# EAGLE design KL02BadgeLeds (EAGLE 6.5.0)
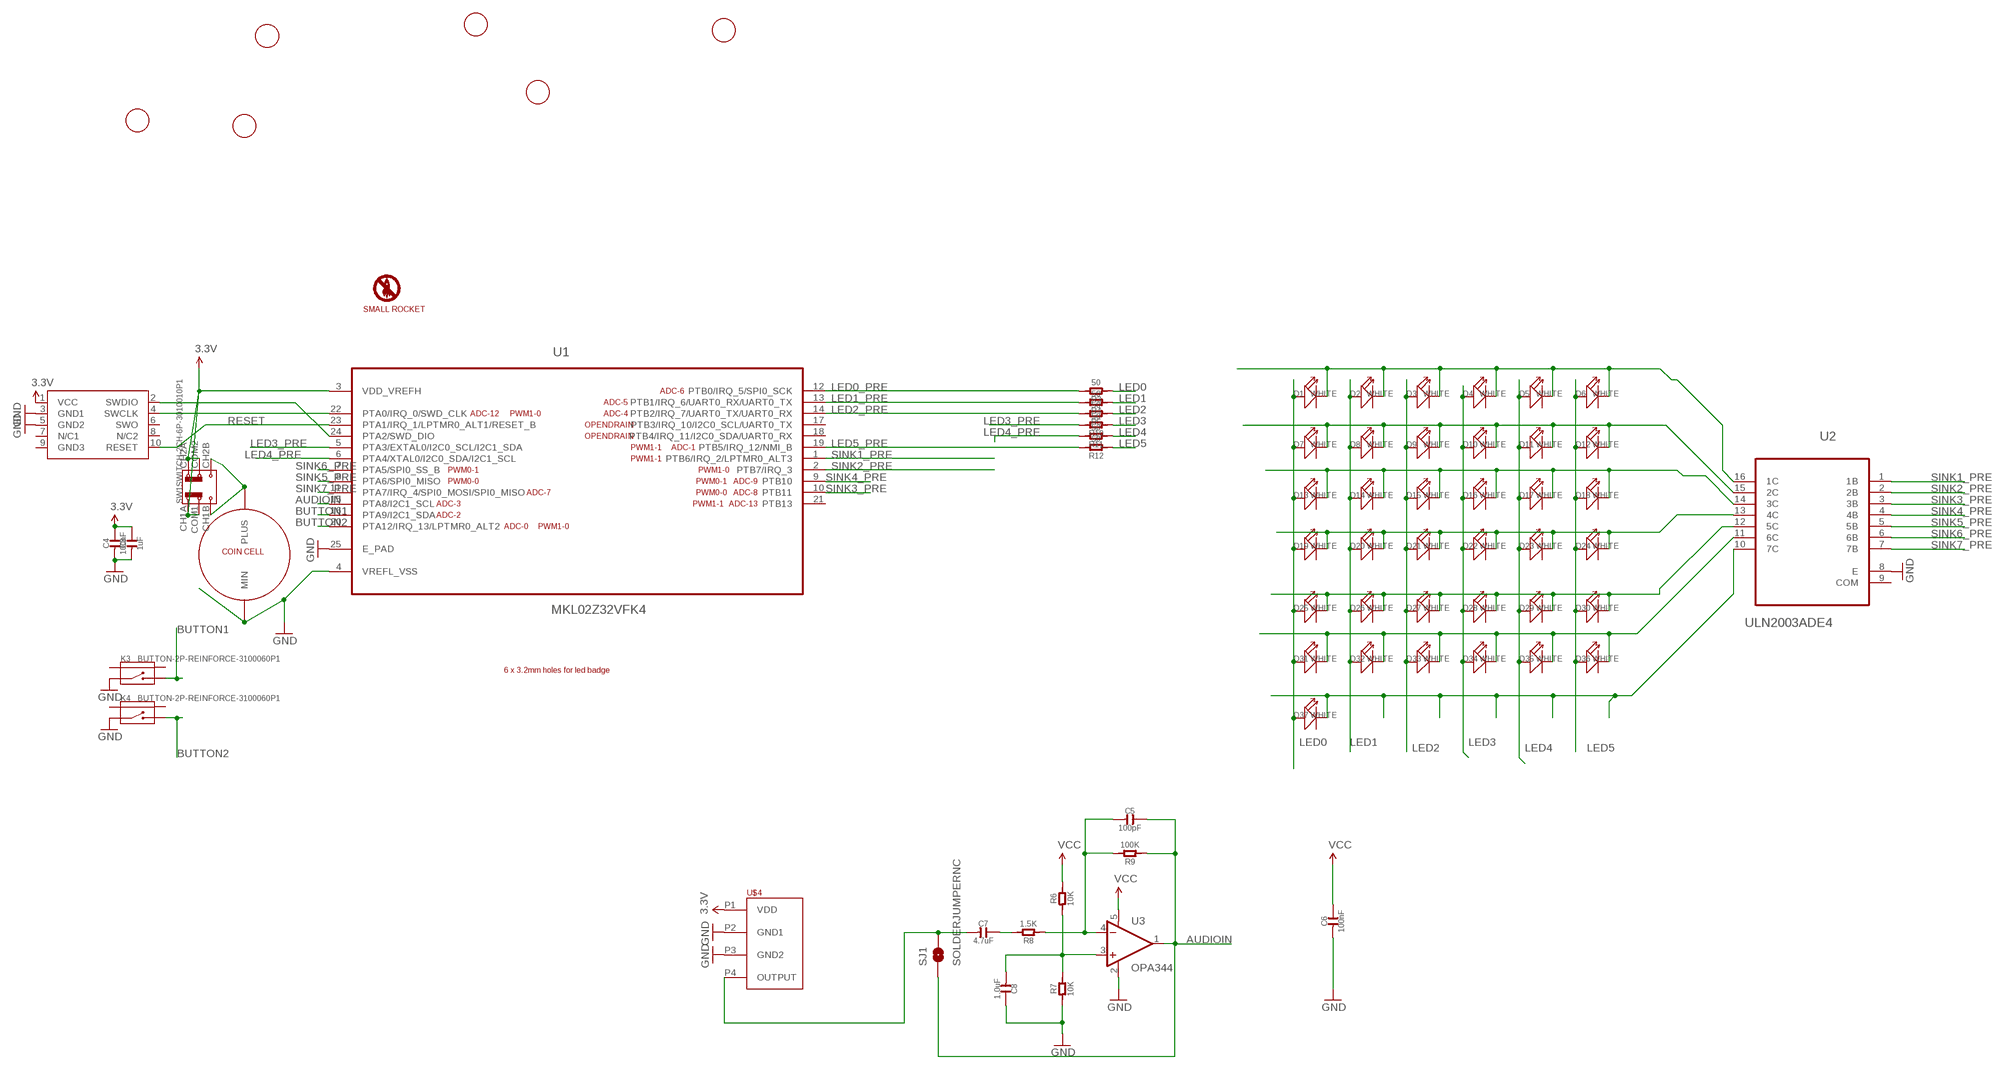
[diagram p0: schematic, sheet 1]

## Parts
C3  1uF  C-0603  [C0603]
C4  100nF  C-0603  [C0603]
C5  100pF  C-0603  [C0603]
C6  100nF  C-0603  [C0603]
C7  4.7uF  C-0603  [C0603]
C8  1.0uF  C-0603  [C0603]
D1  WHITE  LED  [LED0805]
D2  WHITE  LED  [LED0805]
D3  WHITE  LED  [LED0805]
D4  WHITE  LED  [LED0805]
D5  WHITE  LED  [LED0805]
D6  WHITE  LED  [LED0805]
D7  WHITE  LED  [LED0805]
D8  WHITE  LED  [LED0805]
D9  WHITE  LED  [LED0805]
D10  WHITE  LED  [LED0805]
D11  WHITE  LED  [LED0805]
D12  WHITE  LED  [LED0805]
D13  WHITE  LED  [LED0805]
D14  WHITE  LED  [LED0805]
D15  WHITE  LED  [LED0805]
D16  WHITE  LED  [LED0805]
D17  WHITE  LED  [LED0805]
D18  WHITE  LED  [LED0805]
D19  WHITE  LED  [LED0805]
D20  WHITE  LED  [LED0805]
D21  WHITE  LED  [LED0805]
D22  WHITE  LED  [LED0805]
D23  WHITE  LED  [LED0805]
D24  WHITE  LED  [LED0805]
D25  WHITE  LED  [LED0805]
D26  WHITE  LED  [LED0805]
D27  WHITE  LED  [LED0805]
D28  WHITE  LED  [LED0805]
D29  WHITE  LED  [LED0805]
D30  WHITE  LED  [LED0805]
D31  WHITE  LED  [LED0805]
D32  WHITE  LED  [LED0805]
D33  WHITE  LED  [LED0805]
D34  WHITE  LED  [LED0805]
D35  WHITE  LED  [LED0805]
D36  WHITE  LED  [LED0805]
D37  WHITE  LED  [LED0805]
K3  BUTTON-2P-REINFORCE-3100060P1  [4P-SMD-7.0X3.5X3.5H-90D]
K4  BUTTON-2P-REINFORCE-3100060P1  [4P-SMD-7.0X3.5X3.5H-90D]
R3  50  R-0603  [R0603]
R4  50  R-0603  [R0603]
R5  50  R-0603  [R0603]
R6  10K  R-0603  [R0603]
R7  10K  R-0603  [R0603]
R8  1.5K  R-0603  [R0603]
R9  100K  R-0603  [R0603]
R10  50  R-0603  [R0603]
R11  50  R-0603  [R0603]
R12  50  R-0603  [R0603]
SJ1  SOLDERJUMPERNC  [SJ_2S]
SW1  SWITCH-2CH-6P-3010010P1  [6P-2CH-2.54-9.1X3.5X3.2+2H]
SWD1  CORTEX_SWD  [M50-3600542]
U1  MKL02Z32VFK4  [QFN50P400X400X100-25N]
U2  ULN2003ADE4  [SOIC127P600X175-16N]
U3  OPA344  [SOT23-5]
U$1  SMALLROCKET  [SMALLROCKET]
U$2  COINCELL  [2032HOLDER-SZ]
U$3  FIDUCIAL  [FIDUCIAL_1MM]
U$4  WM7120A  [LGAMS4]
U$5  BADGE_HOLES  [BADGEHOLES]
U$6  FIDUCIAL  [FIDUCIAL_1MM]
U$7  FIDUCIAL  [FIDUCIAL_1MM]
U$8  FIDUCIAL  [FIDUCIAL_1MM]
U$9  FIDUCIAL  [FIDUCIAL_1MM]
U$10  FIDUCIAL  [FIDUCIAL_1MM]

## Nets
3.3V: C3.2 C4.2 C6.2 R6.2 SW1.CH1A SW1.CH2A SW1.COM1 SW1.COM2 SWD1.1(VCC) U1.3(VDD_VREFH) U3.5(V+) U$4.P1(VDD) ; supply symbol labelled VCC
AUDIOIN: C5.2 R9.1 SJ1.1 U1.15(PTA8/I2C1_SCL) U3.1(OUT)
BUTTON1: K3.2 U1.16(PTA9/I2C1_SDA)
BUTTON2: K4.2 U1.20(PTA12/IRQ_13/LPTMR0_ALT2)
GND: C3.1 C4.1 C6.1 C8.2 K3.1 K4.1 R7.1 SWD1.3(GND1) SWD1.5(GND2) U1.4(VREFL_VSS) U1.25(E_PAD) U2.8(E) U3.2(V-) U$2.MIN U$4.P2(GND1) U$4.P3(GND2)
LED0: D1.+ D7.+ D13.+ D19.+ D25.+ D31.+ D37.+ R3.1
LED0_PRE: R3.2 U1.12(PTB0/IRQ_5/SPI0_SCK)
LED1: D2.+ D8.+ D14.+ D20.+ D26.+ D32.+ R4.1
LED1_PRE: R4.2 U1.13(PTB1/IRQ_6/UART0_RX/UART0_TX)
LED2: D3.+ D9.+ D15.+ D21.+ D27.+ D33.+ R5.1
LED2_PRE: R5.2 U1.14(PTB2/IRQ_7/UART0_TX/UART0_RX)
LED3: D4.+ D10.+ D16.+ D22.+ D28.+ D34.+ R10.1
LED3_PRE: R10.2 U1.5(PTA3/EXTAL0/I2C0_SCL/I2C1_SDA)
LED4: D5.+ D11.+ D17.+ D23.+ D29.+ D35.+ R11.1
LED4_PRE: R11.2 U1.6(PTA4/XTAL0/I2C0_SDA/I2C1_SCL)
LED5: D6.+ D12.+ D18.+ D24.+ D30.+ D36.+ R12.1
LED5_PRE: R12.2 U1.19(PTB5/IRQ_12/NMI_B)
N$1: SW1.CH1B SW1.CH2B U$2.PLUS
N$5: SWD1.4(SWCLK) U1.22(PTA0/IRQ_0/SWD_CLK)
N$7: SWD1.2(SWDIO) U1.24(PTA2/SWD_DIO)
N$8: C7.1 SJ1.2 U$4.P4(OUTPUT)
N$9: C5.1 R8.1 R9.2 U3.4(-IN)
N$10: C7.2 R8.2
N$11: C8.1 R6.1 R7.2 U3.3(+IN)
RESET: SWD1.10(RESET) U1.23(PTA1/IRQ_1/LPTMR0_ALT1/RESET_B)
SINK1: D1.- D2.- D3.- D4.- D5.- D6.- U2.16(1C)
SINK1_PRE: U1.1(PTB6/IRQ_2/LPTMR0_ALT3) U2.1(1B)
SINK2: D7.- D8.- D9.- D10.- D11.- D12.- U2.15(2C)
SINK2_PRE: U1.2(PTB7/IRQ_3) U2.2(2B)
SINK3: D13.- D14.- D15.- D16.- D17.- D18.- U2.14(3C)
SINK3_PRE: U1.10(PTB11) U2.3(3B)
SINK4: D19.- D20.- D21.- D22.- D23.- D24.- U2.13(4C)
SINK4_PRE: U1.9(PTB10) U2.4(4B)
SINK5: D25.- D26.- D27.- D28.- D29.- D30.- U2.12(5C)
SINK5_PRE: U1.8(PTA6/SPI0_MISO) U2.5(5B)
SINK6: D31.- D32.- D33.- D34.- D35.- D36.- U2.11(6C)
SINK6_PRE: U1.7(PTA5/SPI0_SS_B) U2.6(6B)
SINK7: D37.- U2.10(7C)
SINK7_PRE: U1.11(PTA7/IRQ_4/SPI0_MOSI/SPI0_MISO) U2.7(7B)
Unconnected: K3.S1 K3.S2 K4.S1 K4.S2 SWD1.6(SWO) SWD1.7(N/C1) SWD1.8(N/C2) SWD1.9(GND3) U1.17(PTB3/IRQ_10/I2C0_SCL/UART0_TX) U1.18(PTB4/IRQ_11/I2C0_SDA/UART0_RX) U1.21(PTB13) U2.9(COM)

## Library data of the parts
C3-C8 = OPL:C*
D1-D37 = BatteryHolder:LED*: LED
K3 K4 = OPL:BUTTON-2P-REINFORCE: TS-1188E http://www.best-dz.com/?thread-374-2.html SMD Button
R3-R12 = OPL:R*
SJ1 = SparkFun-Passives:SOLDERJUMPER: Solder Jumper Standard SMD solder jumper. Used to automate production. Two varients : Normally Open and Normally Closed are the same, but have different paste layers. NC will have a large amount of paste and should jumper during reflow.
SW1 = OPL:SWITCH-2CH-6P*: MS-22D18 G2 ROHS
SWD1 = carrilib with jtags:CORTEX_SWD: .05" Cortex M Connector in SWD mode Manufacturer: Generic Part Number: Cortex M SWD Notes: I use Harwin M50-3600542 connectors
U1 = FarnellThings:MKL02Z32VFK4: IC, MCU, 32BIT, CORTEX M0+, 48MHZ, QFN-24; MPN: MKL02Z32VFK4; OC_FARNELL: 2321481; OC_NEWARK: 61W9887; PACKAGE: QFN-24; SUPPLIER: FREESCALE SEMICONDUCTOR
U2 = BatteryHolder:ULN2003ADE4: DARLINGTON TRANSISTOR ARRAYS; MPN: ULN2003ADE4; OC_FARNELL: 1125398; OC_NEWARK: 93K1078; PACKAGE: SOIC-16; SUPPLIER: Texas Instruments
U3 = SparkFun:OPA344
U$1 = zephod-components:SMALLROCKET
U$2 = BatteryHolder:COINCELL
U$3 U$6-U$10 = adafruit:FIDUCIAL: For use by pick and place machines to calibrate the vision/machine, 1mm By microbuilder.eu
U$4 = KL02Z:WM7120A
U$5 = BatteryHolder:BADGE_HOLES

## Net classes
0 default: width 0.203 mm

## Board
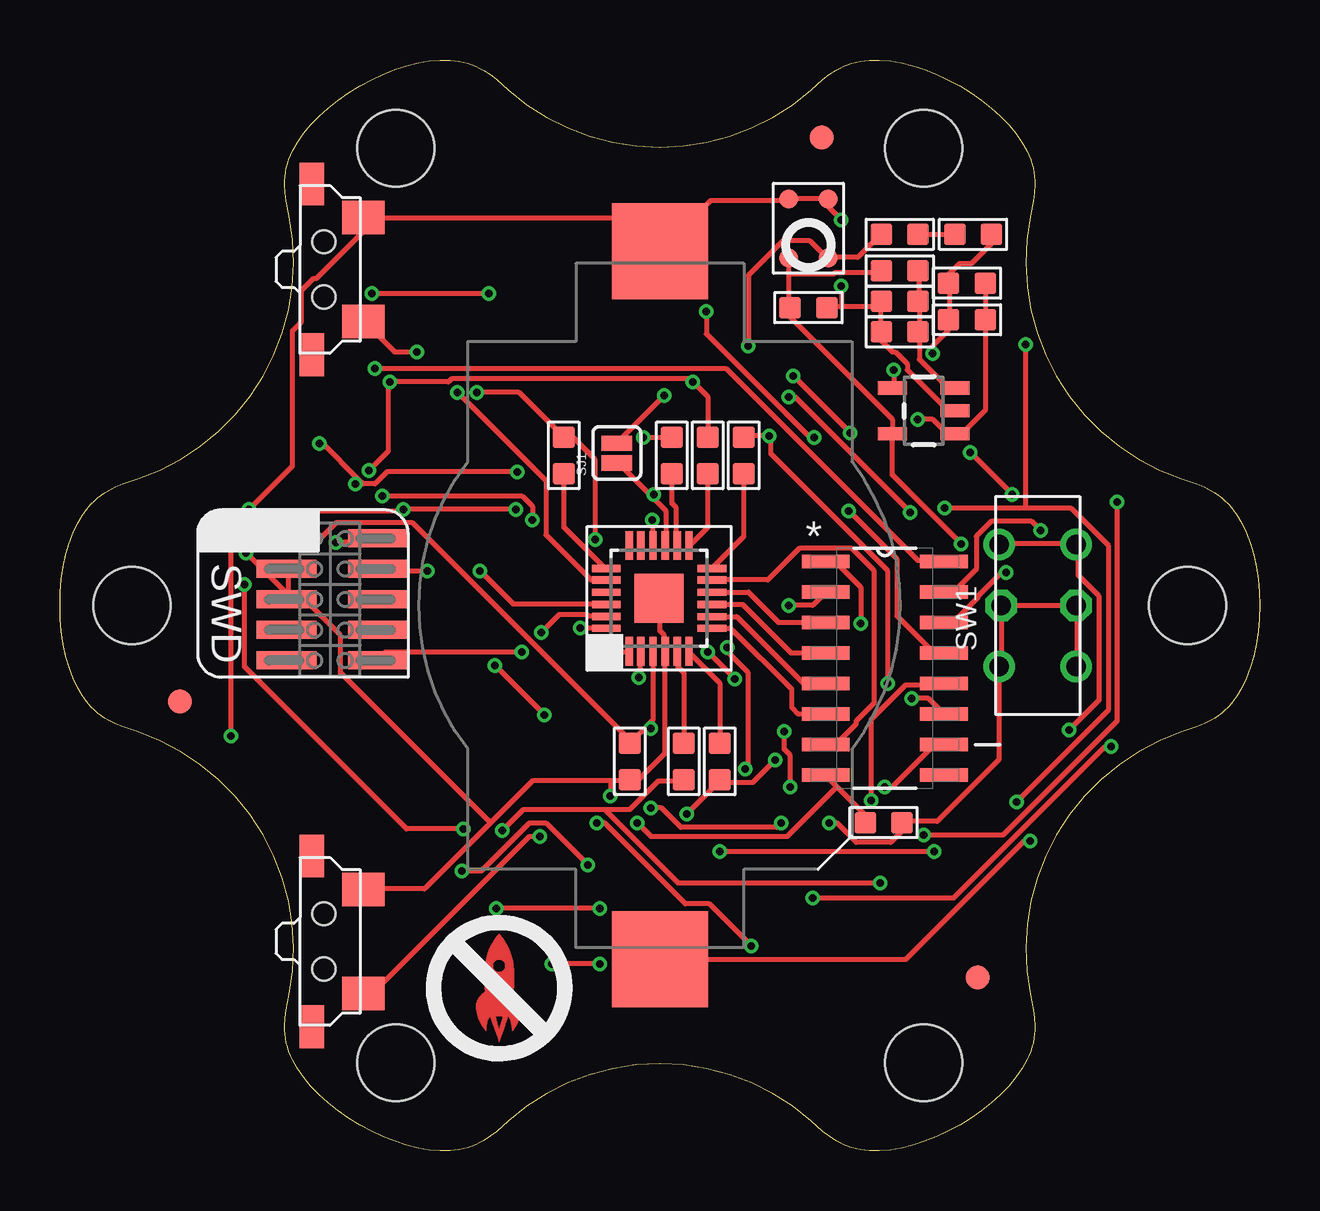
[diagram p1: board, top side]
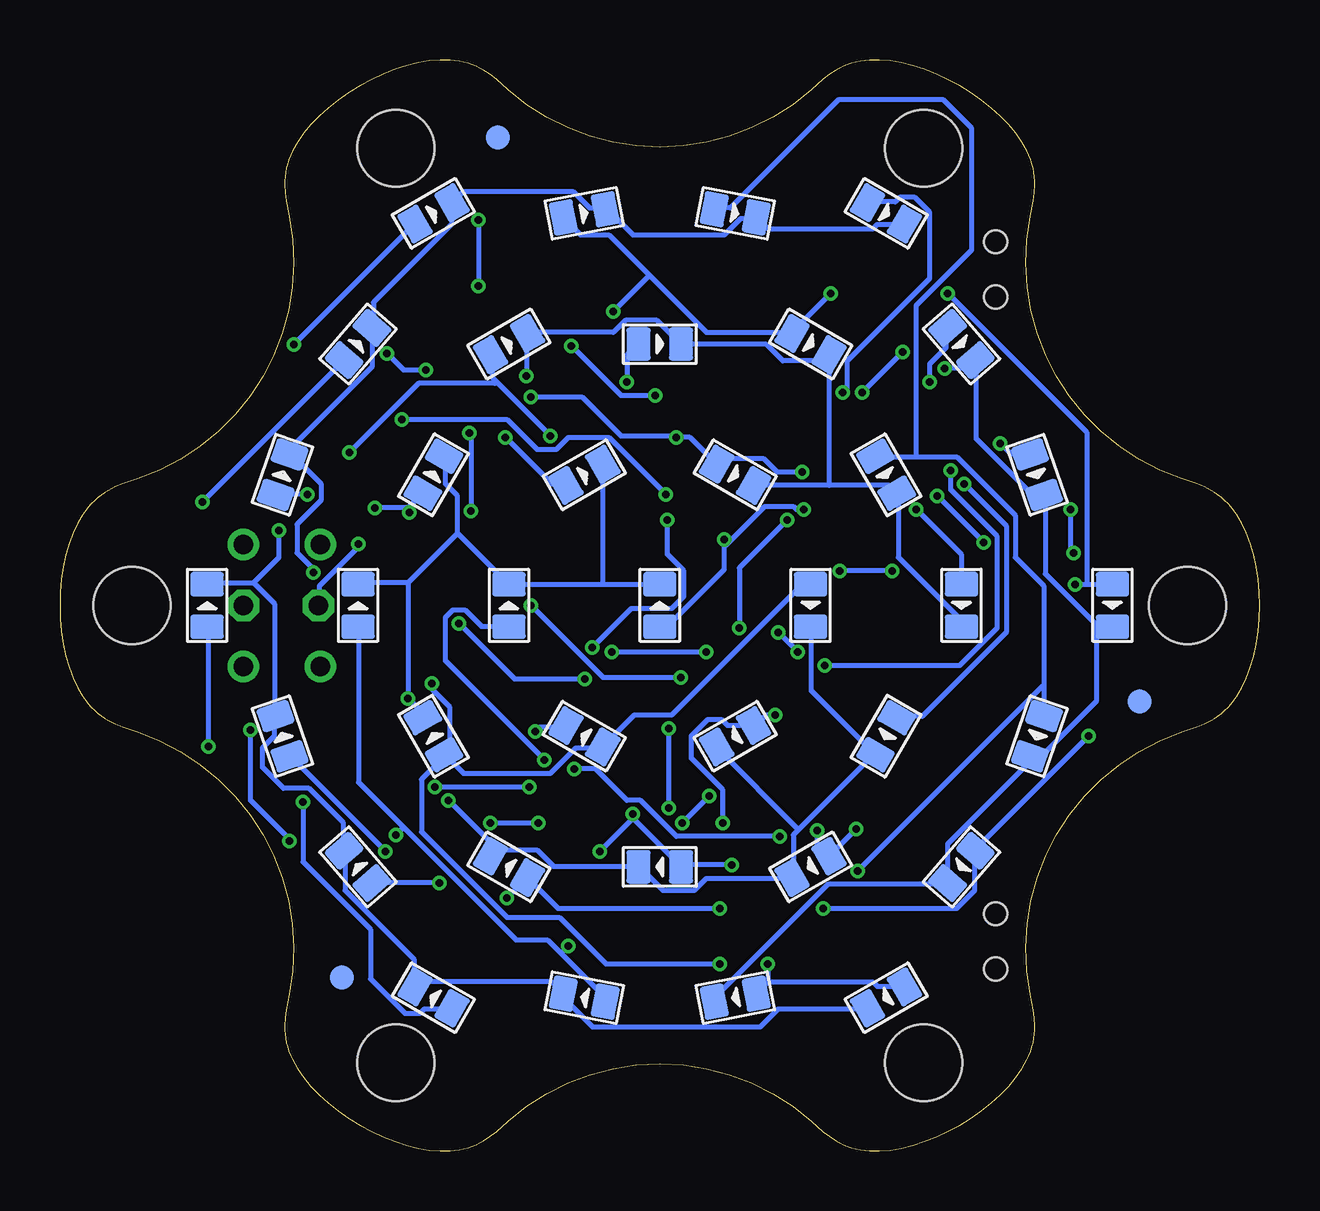
[diagram p2: board, bottom side, seen from below]

Size 50 x 45.45 mm. Coordinates in mm from the lower left corner, seen from the top.
Outline: 18.68,44.21 19.46,43.6 20.29,43.07 21.17,42.62 22.09,42.28 23.04,42.03 24.02,41.87 25,41.82 25.98,41.87 26.96,42.03 27.91,42.28 28.83,42.62 29.71,43.07 30.54,43.6 31.32,44.21 31.81,44.65 32.07,44.85 32.35,45.04 32.5,45.12 32.66,45.19 32.82,45.26 32.99,45.32 33.17,45.36 33.36,45.4 33.55,45.43 33.75,45.45 34.17,45.45 34.61,45.42 35.07,45.34 35.55,45.22 36.04,45.06 36.53,44.87 37.02,44.64 37.5,44.38 37.97,44.09 38.41,43.78 38.82,43.45 39.2,43.11 39.55,42.76 39.85,42.39 40.1,42.03 40.3,41.66 40.39,41.48 40.46,41.3 40.52,41.12 40.56,40.94 40.6,40.77 40.62,40.59 40.64,40.42 40.64,40.25 40.62,39.91 40.58,39.58 40.45,38.94 40.3,37.96 40.26,36.98 40.32,35.99 40.48,35.02 40.73,34.07 41.09,33.15 41.54,32.27 42.07,31.45 42.69,30.68 43.39,29.98 44.15,29.36 44.97,28.82 45.84,28.36 46.76,28 47.39,27.79 47.7,27.67 48,27.51 48.14,27.42 48.28,27.33 48.42,27.22 48.56,27.1 48.69,26.97 48.81,26.83 48.94,26.68 49.05,26.51 49.27,26.15 49.45,25.75 49.62,25.31 49.75,24.84 49.86,24.34 49.94,23.81 49.98,23.27 50,22.73 49.98,22.18 49.94,21.64 49.86,21.12 49.75,20.62 49.62,20.14 49.45,19.7 49.27,19.3 49.05,18.94 48.94,18.78 48.81,18.63 48.69,18.49 48.56,18.36 48.42,18.24 48.28,18.13 48.14,18.03 48,17.94 47.7,17.79 47.39,17.67 46.76,17.46 45.84,17.09 44.97,16.64 44.15,16.1 43.39,15.47 42.69,14.77 42.07,14.01 41.54,13.18 41.09,12.3 40.73,11.38 40.48,10.43 40.32,9.46 40.26,8.48 40.3,7.49 40.45,6.52 40.58,5.87 40.62,5.54 40.64,5.21 40.64,5.03 40.62,4.86 40.6,4.69 40.56,4.51 40.52,4.33 40.46,4.15 40.39,3.97 40.3,3.79 40.1,3.43 39.85,3.06 39.55,2.7 39.2,2.34 38.82,2 38.41,1.67 37.97,1.36 37.5,1.08 37.02,0.82 36.53,0.59 36.04,0.39 35.55,0.23 35.07,0.12 34.61,0.04 34.17,0 33.75,0.01 33.55,0.02 33.36,0.05 33.17,0.09 32.99,0.14 32.82,0.2 32.66,0.26 32.5,0.34 32.35,0.42 32.07,0.6 31.81,0.81 31.32,1.25 30.54,1.86 29.71,2.39 28.83,2.83 27.91,3.18 26.96,3.43 25.98,3.58 25,3.63 24.02,3.58 23.04,3.43 22.09,3.18 21.17,2.83 20.29,2.39 19.46,1.86 18.68,1.25 18.19,0.81 17.93,0.6 17.65,0.42 17.5,0.34 17.34,0.26 17.18,0.2 17.01,0.14 16.83,0.09 16.64,0.05 16.45,0.02 16.25,0.01 15.83,0 15.39,0.04 14.93,0.12 14.45,0.23 13.96,0.39 13.47,0.59 12.98,0.82 12.5,1.08 12.04,1.36 11.59,1.67 11.18,2 10.79,2.34 10.45,2.7 10.15,3.06 9.9,3.43 9.7,3.79 9.61,3.97 9.54,4.15 9.48,4.33 9.44,4.51 9.4,4.69 9.38,4.86 9.36,5.03 9.36,5.21 9.38,5.54 9.42,5.87 9.55,6.52 9.7,7.49 9.74,8.48 9.68,9.46 9.53,10.43 9.27,11.38 8.91,12.3 8.46,13.18 7.93,14.01 7.31,14.77 6.61,15.47 5.85,16.1 5.03,16.64 4.16,17.09 3.24,17.46 2.61,17.67 2.3,17.79 2,17.94 1.86,18.03 1.72,18.13 1.58,18.24 1.44,18.36 1.31,18.49 1.18,18.63 1.06,18.78 0.95,18.94 0.73,19.3 0.55,19.7 0.38,20.14 0.25,20.62 0.14,21.12 0.06,21.64 0.02,22.18 0,22.73 0.02,23.27 0.06,23.81 0.14,24.34 0.25,24.84 0.38,25.31 0.55,25.75 0.73,26.15 0.95,26.51 1.06,26.68 1.18,26.83 1.31,26.97 1.44,27.1 1.58,27.22 1.72,27.33 1.86,27.42 2,27.51 2.3,27.67 2.61,27.79 3.24,28 4.16,28.36 5.03,28.82 5.85,29.36 6.61,29.98 7.31,30.68 7.93,31.45 8.46,32.27 8.91,33.15 9.27,34.07 9.53,35.02 9.68,35.99 9.74,36.98 9.7,37.96 9.55,38.94 9.42,39.58 9.38,39.91 9.36,40.25 9.36,40.42 9.38,40.59 9.4,40.77 9.44,40.94 9.48,41.12 9.54,41.3 9.61,41.48 9.7,41.66 9.9,42.03 10.15,42.39 10.45,42.76 10.79,43.11 11.18,43.45 11.59,43.78 12.04,44.09 12.5,44.38 12.98,44.64 13.47,44.87 13.96,45.06 14.45,45.22 14.93,45.34 15.39,45.42 15.83,45.45 16.25,45.45 16.45,45.43 16.64,45.4 16.83,45.36 17.01,45.32 17.18,45.26 17.34,45.19 17.5,45.12 17.65,45.04 17.93,44.85 18.19,44.65 18.68,44.21
Copper layers (1*16): Top 0.035mm / dielectric 1.5mm / Bottom 0.035mm
Design rules "ITEADstudio_DRC": minimum track width 6mil, minimum drill 12mil, track to track 6mil, track to pad 6mil, pad to pad 6mil, via to via 6mil, smd to smd 0mil, copper to edge 10mil, drill to drill 10mil, minimum pad ring 10mil, minimum via ring 6mil, stop-mask expansion 2mil, vias tented up to drill 100mil, thermal gap 10mil

### Footprints (pad centres in the part's own frame; a part is rotated, then mirrored left to right if it is on the bottom)
C0603 = smd 0.889 x 0.889: 1 -0.762,0; 2 0.762,0
LED0805 = smd 1.016 x 1.397: + -0.889,0; - 0.889,0
4P-SMD-7.0X3.5X3.5H-90D = smd 1.397 x 1.778: 1 -2.159,1.651; 2 2.159,1.651 | smd 1.778 x 1.016: S1 -3.556,-0.508; S2 3.556,-0.508 | hole 0.95: -1.15,0; 1.15,0
R0603 = smd 0.889 x 0.889: 1 -0.762,0; 2 0.762,0
SJ_2S = smd 0.635 x 1.27: 1 -0.412,0; 2 0.412,0
6P-2CH-2.54-9.1X3.5X3.2+2H = drill 0.813 pad 1.27: CH1A -2.54,-1.6; CH1B 2.54,-1.6; CH2A -2.54,1.6; CH2B 2.54,1.6 | drill 0.813 pad 1.27 octagon: COM1 0,-1.6; COM2 0,1.524
M50-3600542 = smd 0.75 x 2.5: 1 -2.54,-1.81; 2 -2.54,2; 3 -1.27,-1.81; 4 -1.27,2; 5 0,-1.81; 6 0,2; 7 1.27,-1.81; 8 1.27,2; 9 2.54,-1.81; 10 2.54,2
QFN50P400X400X100-25N = smd 1.2 x 0.3: 1 -2.2,1.245; 2 -2.2,0.762; 3 -2.2,0.254; 4 -2.2,-0.254; 5 -2.2,-0.762; 6 -2.2,-1.245; 13 2.2,-1.245; 14 2.2,-0.762; 15 2.2,-0.254; 16 2.2,0.254; 17 2.2,0.762; 18 2.2,1.245 | smd 0.3 x 1.2: 7 -1.245,-2.2; 8 -0.762,-2.2; 9 -0.254,-2.2; 10 0.254,-2.2; 11 0.762,-2.2; 12 1.245,-2.2; 19 1.245,2.2; 20 0.762,2.2; 21 0.254,2.2; 22 -0.254,2.2 | smd 0.305 x 1.2: 23 -0.762,2.2; 24 -1.245,2.2 | smd 2.032 x 2.032: 25 0,0
SOIC127P600X175-16N = smd 1.981 x 0.559: 1 -2.464,4.445; 2 -2.464,3.175; 3 -2.464,1.905; 4 -2.464,0.635; 5 -2.464,-0.635; 6 -2.464,-1.905; 7 -2.464,-3.175; 8 -2.464,-4.445; 9 2.464,-4.445; 10 2.464,-3.175; 11 2.464,-1.905; 12 2.464,-0.635; 13 2.464,0.635; 14 2.464,1.905; 15 2.464,3.175; 16 2.464,4.445
SOT23-5 = smd 0.55 x 1.2: 1 -0.95,-1.3; 2 0,-1.3; 3 0.95,-1.3; 4 0.95,1.3; 5 -0.95,1.3
2032HOLDER-SZ = smd 4 x 4: MIN 0,-14.75; PLUS 0,14.75
FIDUCIAL_1MM = smd 1 x 1: 1 0,0
LGAMS4 = smd 0.8 x 0.8: P1 0.825,1.23; P2 0.825,-1.23; P3 -0.825,-1.23; P4 -0.825,1.23
BADGEHOLES = hole 3.2: -11,19.05; 11,19.05; 22,0; 11,-19.05; -11,-19.05; -22,0

### Placement (x,y rotation side)
C3  34.33,13.68 0 top
C4  23.75,16.23 90 top
C5  37.8,36.16 0 top
C6  31.2,35.14 180 top
C7  35.01,38.19 0 top
C8  35.01,34.12 180 top
D1  21.86,6.39 190.9 bottom
D2  12.42,33.62 310.9 bottom
D3  9.28,28.17 289.1 bottom
D4  6.13,22.73 270 bottom
D5  9.28,17.28 250.9 bottom
D6  12.42,11.83 229.1 bottom
D7  15.57,6.39 210 bottom
D8  28.14,6.39 169.1 bottom
D9  34.43,6.39 150 bottom
D10  37.58,11.83 130.9 bottom
D11  40.72,17.28 109.1 bottom
D12  43.87,22.73 90 bottom
D13  40.72,28.17 70.9 bottom
D14  37.58,33.62 49.1 bottom
D15  34.43,39.07 30 bottom
D16  28.14,39.07 10.9 bottom
D17  21.86,39.07 349.1 bottom
D18  15.57,39.07 330 bottom
D19  31.29,33.62 30 bottom
D20  25,33.62 0 bottom
D21  21.86,28.17 330 bottom
D22  18.71,33.62 330 bottom
D23  15.57,28.17 300 bottom
D24  12.42,22.73 270 bottom
D25  18.71,22.73 270 bottom
D26  21.86,17.28 210 bottom
D27  15.57,17.28 240 bottom
D28  18.71,11.83 210 bottom
D29  25,11.83 180 bottom
D30  31.29,11.83 150 bottom
D31  34.43,17.28 120 bottom
D32  37.58,22.73 90 bottom
D33  34.43,28.17 60 bottom
D34  28.14,28.17 30 bottom
D35  31.29,22.73 90 bottom
D36  25,22.73 90 bottom
D37  28.14,17.28 150 bottom
K3  11,8.73 270 top
K4  11,36.73 270 top
R3  28.5,28.98 270 top
R4  27,28.98 270 top
R5  25.5,28.98 270 top
R6  35.01,36.66 180 top
R7  35.01,35.39 0 top
R8  38.06,38.19 180 top
R9  37.8,34.63 180 top
R10  26,16.23 90 top
R11  27.5,16.23 90 top
R12  21,28.98 270 top
SJ1  23.21,29.08 90 top
SW1  40.75,22.73 90 top
SWD1  11.25,22.98 270 top
U1  24.97,23.02 90 top
U2  34.38,20.11 0 top
U3  36,30.84 90 top
U$1  18,6.48 0 top
U$2  25,22.73 180 top
U$3  5,18.73 0 top
U$4  31.2,38.44 180 top
U$5  25,22.73 0 top
U$6  38.25,7.23 0 top
U$7  31.75,42.23 0 top
U$8  5,18.73 0 bottom
U$9  38.25,7.23 0 bottom
U$10  31.75,42.23 0 bottom

### Tracks (layer width: path | path; a pad name or v marks a point on that pad's centre or on a via)
3.3V  (via drill 0.3)
  Top 0.203: U1.3 24.72,17.96 24.49,17.73 | 24.49,17.73 C4.2 23.75,17.1 14.69,26.17 11.5,26.17 10.88,25.54 9.5,25.54 SWD1.1 | 30.38,36.54 30.38,35.17 C6.2 30.44,35.04 30.44,34.73 34.69,30.48 34.69,29.92 U3.5 34.69,29.79 34.69,28.17 v37.56,25.29 | 30.38,36.54 30.38,37.17 U$4.P1 | 30.38,36.54 32.25,36.54 32.31,36.6 34.19,36.6 R6.2 | SW1.CH1A 42.38,20.23 42.38,22.73 SW1.COM1 SW1.COM2 39.25,22.73 39.25,20.23 SW1.CH2A 39.12,20.17 39.12,16.29 36.56,13.73 35.12,13.73 C3.2 35.44,13.67 34.62,12.85 33.19,12.85 32.38,13.67 v32.06,13.67 | v24.62,14.29 25.06,14.29 25.88,13.48 29.88,13.48 v30.06,13.67 | v24.62,17.6 24.49,17.73
  Bottom 0.203: v37.56,25.29 37.56,25.17 39.19,23.54 39.19,22.73 SW1.COM2 | v24.62,14.29 v24.62,17.6 | v32.06,13.67 v30.06,13.67
AUDIOIN  (via drill 0.3)
  Top 0.203: 24.62,27.29 23.25,28.67 SJ1.1 | 24.62,27.29 25.25,26.67 25.25,25.23 U1.15 | C5.2 38.56,36.1 38.56,34.67 R9.1 38.56,34.54 38.56,30.85 37.62,29.92 37.31,29.92 U3.1 37.25,29.98 36.88,29.98 36.38,30.48 v35.75,30.48 | v24.75,27.35 24.69,27.35 24.62,27.29
  Bottom 0.203: v24.75,27.35 27.12,29.73 28.81,29.73 29.31,29.23 30.12,29.23 31.38,30.48 v35.75,30.48
BUTTON1  (via drill 0.3)
  Top 0.203: v24.69,26.29 24.69,25.23 U1.16 | v27.81,20.98 27.81,20.79 28.69,19.92 28.69,16.04 v28.56,15.92 | v20,13.1 19.56,13.1 13.06,6.6 12.69,6.6 K3.2
  Bottom 0.203: v24.69,26.29 24.69,24.85 24,24.17 24,23.1 24.5,22.6 26.19,22.6 v27.81,20.98 | v28.56,15.92 27.69,15.92 26.38,14.6 25.81,14.6 24.31,13.1 v20,13.1
BUTTON2  (via drill 0.3)
  Top 0.203: v16.56,31.6 20.25,27.92 20.25,25.67 22.12,23.79 22.75,23.79 U1.20 | v14.88,33.29 13.94,33.29 12.69,34.54 K4.2
  Bottom 0.203: v14.88,33.29 v16.56,31.6
GND  (via drill 0.3)
  Top 0.203: 32.56,35.17 34,35.17 34.19,35.35 R7.1 34.19,35.23 34.19,34.17 C8.2 34.25,34.04 34.25,33.73 34.69,33.29 34.81,33.29 35.31,32.79 35.31,32.54 37,30.85 37.25,30.85 U3.2 | 32.56,35.17 32,35.17 C6.1 | v32.56,36.04 32.56,35.17 | v32.56,38.79 31.75,39.6 U$4.P3 32,39.67 U$4.P2 30.31,39.6 27.12,39.6 U$2.MIN 26.25,38.85 12.69,38.85 K4.1 12.62,38.79 12.62,38.29 10.69,36.35 10.56,36.35 10.06,35.85 10.06,34.54 9.69,34.17 9.69,28.54 v7.88,26.73 | SWD1.5 9.5,22.98 9.5,24.23 SWD1.3 | 32.38,15.17 31.94,15.6 U2.8 | 32.38,15.17 33.56,13.98 33.56,13.73 C3.1 | 17.94,13.67 19.69,15.42 22.94,15.42 | 17.94,13.67 15.19,10.92 12.69,10.92 K3.1 | 22.94,15.42 23.69,15.42 C4.1 24.12,15.48 25.19,16.54 25.19,20.79 U1.4 25.19,20.92 25.19,21.48 25,21.67 25,22.98 U1.25 | 32.38,15.17 30.31,13.1 24.62,13.1 v24.06,13.67 | 22.94,15.42 v22.94,14.79 | 17.94,13.67 11.69,19.92 11.69,21.48 10.25,22.92 9.56,22.92 SWD1.5 | v7.75,24.92 9.44,23.23 SWD1.5
  Bottom 0.203: v32.56,38.79 v32.56,36.04 | v22.94,14.79 v24.06,13.67 | v7.88,26.73 7.88,25.04 v7.75,24.92
LED0  (via drill 0.3)
  Top 0.203: R3.1 28.5,29.79 v29.56,29.79 29.62,29.73 29.62,29.04 34.5,24.17 v34.5,19.48 | v37.94,29.1 v39.69,27.35 | v22.5,7.79 v20.5,7.79
  Bottom 0.203: 31.81,32.04 32,32.23 32,33.17 D19.+ | 31.81,32.04 v29.56,29.79 | v39.69,27.35 41,27.35 D13.+ | v37.94,29.1 35.06,31.98 31.88,31.98 31.81,32.04 | 20.5,7.04 16.12,7.04 15.94,6.85 14.81,6.85 D7.+ | 20.5,7.04 20.94,6.6 D1.+ | D31.+ 33.94,16.48 33.19,15.73 29.56,15.73 28.5,16.79 27.38,16.79 D37.+ 27.31,16.92 26.06,18.17 24.5,18.17 19.06,23.6 18.75,23.6 D25.+ | v20.5,7.79 20.5,7.04 | v22.5,7.79 27.25,7.79 29.19,9.73 31.38,9.73 34.94,13.29 34.94,15.48 34,16.42 D31.+ | v34.5,19.48 34.5,19.23 33.75,18.48 33.75,16.42 D31.+
LED0_PRE
  Top 0.203: R3.2 28.5,25.6 27.19,24.29 U1.12
LED1  (via drill 0.3)
  Top 0.203: R4.1 27,31.42 v26.38,32.04 26.25,32.17 16.31,32.17 16.19,32.04 v13.75,32.04 13.69,31.98 13.69,29.17 v12.88,28.35 | v22.38,13.67 22.69,13.67 26.06,10.29 27.06,10.29 v28.81,8.54 | v44.06,27.04 44.06,17.92 39.31,13.17 v36,13.17 | v20.19,18.17 v18.12,20.23
  Bottom 0.203: v26.38,32.04 26.38,33.17 25.94,33.6 D20.+ | v13.75,32.04 13.75,32.79 13.06,33.48 13.06,34.29 D2.+ | 29.12,8.23 29.69,8.79 31,8.79 35.69,13.48 | 29.12,8.23 27.31,6.42 27.31,6.23 D8.+ | 35.69,13.48 37.56,15.35 37.56,21.79 D32.+ | v22.38,13.67 22.38,15.04 23.69,16.35 23.69,17.29 23,17.98 22.44,17.98 22.19,17.73 21.12,17.73 D26.+ 21,17.73 20.56,18.17 v20.19,18.17 | 29.12,8.23 v28.81,8.54 | v44.06,27.04 38.19,32.92 D14.+ | 35.69,13.48 v36,13.17 | v12.88,28.35 12.88,27.54 10.94,25.6 10.94,21.79 12.5,20.23 v18.12,20.23
LED1_PRE
  Top 0.203: R4.2 27,25.98 26.25,25.23 U1.13
LED2  (via drill 0.3)
  Top 0.203: v24.31,29.73 R5.1 | v10.81,29.48 10.94,29.48 12.47,27.95 | 12.47,27.95 12.62,27.79 13.12,27.79 13.62,28.29 v19.06,28.29 | 12.47,27.95 v12.31,27.79 | v39.88,14.54 43.69,18.35 43.69,25.23 42.12,26.79 40.25,26.79 | v36.88,26.79 40.25,26.79 | 40.25,26.79 v40.25,33.6 | v30.38,31.42 30.62,31.42 v35.44,26.6
  Bottom 0.203: v10.81,29.48 10.38,29.04 9.62,29.04 D3.+ | v19.06,28.29 20.12,28.29 20.69,28.85 22.75,28.85 D21.+ 22.69,28.67 23.75,29.73 v24.31,29.73 24.38,29.79 26.62,29.79 28.25,31.42 v30.38,31.42 | v12.31,27.79 10.56,26.04 10.56,21.6 14.06,18.1 15.06,18.1 D27.+ | v39.88,14.54 39.88,12.04 37.06,9.23 37.06,7.17 35.62,5.73 35,5.73 34.81,5.92 33.69,5.92 D9.+ | 35.5,26.79 v36.88,26.79 | 35.5,26.79 34.94,27.35 D33.+ | v40.25,33.6 35.25,38.6 D15.+ | v35.44,26.6 35.44,26.73 35.5,26.79
LED2_PRE
  Top 0.203: R5.2 25.5,26.98 25.69,26.79 25.69,25.23 U1.14
LED3  (via drill 0.3)
  Top 0.203: v31.44,29.73 31.25,29.73 26.94,34.04 v26.94,34.98 | 22.75,14.23 19.31,14.23 v18.44,13.35 | 22.75,14.23 23.75,14.23 24.94,15.42 26,15.42 R10.1 | v34.19,11.17 25.75,11.17 22.75,14.17 22.75,14.23 | v7.69,23.6 7.69,20.17 14.44,13.42 v16.81,13.42 | v13,35.73 v17.88,35.73
  Bottom 0.203: 25.44,36.48 27.12,38.17 28.31,38.17 29,38.85 D16.+ | 25.44,36.48 23.06,34.1 19.5,34.1 D22.+ 19.44,34.17 v17.88,35.73 | v31.44,29.73 29.5,27.79 28.94,27.79 D34.+ | 25.44,36.48 v26.94,34.98 | v18.44,13.35 18.44,12.73 18,12.29 D28.+ 17.88,12.35 v16.81,13.42 | v34.19,11.17 36.94,11.17 D10.+ | v7.69,23.6 7.19,23.6 | 7.19,23.6 6.19,23.6 D4.+ | v13,35.73 7.19,29.92 7.19,23.6
LED3_PRE
  Top 0.203: R10.2 26,19.92 25.75,20.17 25.75,20.79 U1.5
LED4  (via drill 0.3)
  Top 0.203: v26.12,14.04 27.5,15.42 R11.1 27.56,15.35 28.88,15.35 v29.81,16.29 | v27.5,12.48 v36.44,12.48 | v22,11.92 20.25,13.67 19.56,13.67 17.56,11.67 v16.75,11.67
  Bottom 0.203: v29.81,16.29 33.94,20.42 33.94,22.23 33.62,22.54 33.12,22.54 32.44,21.85 31.31,21.85 D35.+ | v36.44,12.48 40.38,16.42 D11.+ | v27.5,12.48 26.19,13.79 v26.12,14.04 26.12,13.85 24.12,11.85 D29.+ 24.06,11.92 v22,11.92 | 9,19.35 9,23.54 10.19,24.73 10.19,26.48 12.62,28.92 14.31,28.92 | 9,19.35 9,18.17 D5.+ | 14.31,28.92 16,28.92 D23.+ | 14.31,28.92 14.31,35.23 12,37.54 12,42.6 13.19,43.79 17.56,43.79 22.06,39.29 22.69,39.29 D17.+ | v16.75,11.67 9.06,19.35 9,19.35
LED4_PRE
  Top 0.203: R11.2 27.5,19.48 26.19,20.79 U1.6
LED5  (via drill 0.3)
  Top 0.203: v22.31,25.48 22.31,28.79 21.38,29.73 R12.1 20.94,29.79 19.12,31.6 v17.38,31.6 | v19,26.73 v14.31,26.73 14.25,26.67 8.62,26.67 8.12,26.17 8.06,26.17 7.12,25.23 v7.12,17.29 | v22.5,10.1 v18.19,10.1 | v43.81,16.85 43.56,16.85 37.25,10.54 v31.38,10.54
  Bottom 0.203: D36.+ 25,21.85 24.69,21.85 22.31,24.23 v22.31,25.48 22.25,25.23 20.62,26.85 19.44,26.85 19.31,26.73 v19,26.73 | v14.31,26.73 12.44,24.85 12.44,23.67 D24.+ | v17.38,31.6 17.19,31.79 17.19,32.92 13.75,36.35 13.75,39.1 14.38,39.73 15,39.73 15.19,39.54 16.31,39.54 D18.+ | v18.19,10.1 12.62,10.1 11.88,10.85 11.88,12.48 D6.+ 11.81,12.6 v7.12,17.29 | v22.5,10.1 29.25,10.1 30.5,11.35 D30.+ 30.56,11.35 v31.38,10.54 | v43.81,16.85 43.81,21.79 D12.+
LED5_PRE
  Top 0.203: R12.2 21,25.98 22.75,24.23 U1.19
N$1  (via drill 0.3)
  Top 0.203: SW1.CH2B 39.19,25.29 42.31,25.29 SW1.CH1B 42.44,25.23 42.44,23.98 43.31,23.1 43.31,18.79 v42.06,17.54 | v40.44,12.92 40.19,12.92 35.25,7.98 U$2.PLUS
  Bottom 0.203: v42.06,17.54 42.06,14.6 40.44,12.98 v40.44,12.92
N$5  (via drill 0.3)
  Top 0.203: v17.5,24.17 18.88,22.79 22.75,22.79 U1.22 | v15.31,24.17 13.31,24.17 13.25,24.23 SWD1.4
  Bottom 0.203: v15.31,24.17 v17.5,24.17
N$7  (via drill 0.3)
  Top 0.203: v21.69,21.79 22.75,21.79 U1.24 | v19.69,26.29 19.69,26.85 19.25,27.29 v13.44,27.29 | v11.5,25.35 13.12,25.35 13.25,25.48 SWD1.2
  Bottom 0.203: v21.69,21.79 21.69,24.29 v19.69,26.29 | v11.5,25.35 v13.44,27.29
N$8  (via drill 0.3)
  Top 0.203: C7.1 34.19,38.17 33.25,37.23 32.06,37.23 U$4.P4 31.94,37.23 31.25,37.92 30.12,37.92 28.69,36.48 v28.69,33.54 | v25.19,31.48 23.25,29.54 SJ1.2
  Bottom 0.203: v25.19,31.48 26.62,31.48 v28.69,33.54
N$9  (via drill 0.3)
  Top 0.203: R8.1 38.81,38.17 38.81,37.79 38,36.98 37.5,36.98 37.06,36.54 37.06,36.23 C5.1 37.06,36.1 37.06,34.67 R9.2 37,34.54 37,34.17 36.38,33.54 v36.38,33.23 | v34.75,32.54 34.75,31.79 U3.4
  Bottom 0.203: v34.75,32.54 35.69,32.54 v36.38,33.23
N$10
  Top 0.203: C7.2 35.81,38.17 37.25,38.17 R8.2
N$11
  Top 0.203: R6.1 35.81,36.6 35.81,35.48 R7.2 35.81,35.35 35.81,34.17 C8.1 35.81,34.04 35.81,32.98 37,31.79 37.25,31.79 U3.3
RESET  (via drill 0.3)
  Top 0.203: v20.06,21.6 20.81,22.35 21.94,22.35 22,22.29 22.75,22.29 U1.23 | v19.25,20.79 13.56,20.79 13.25,20.48 SWD1.10
  Bottom 0.203: v19.25,20.79 v20.06,21.6
SINK1  (via drill 0.3)
  Top 0.203: v13.12,32.6 27.75,32.6 35.75,24.6 36.81,24.6 U2.16
  Bottom 0.203: D1.- 22.69,6.23 22.69,6.42 18,11.1 13.06,11.1 D6.- 13,12.79 9.62,16.17 9.62,16.42 D5.- 9.5,16.48 9.06,16.48 6.81,18.73 6.81,21.79 D4.- 6.19,21.85 6.75,21.85 8.94,24.04 8.94,27.29 D3.- 9,26.85 11.81,29.67 11.81,32.92 D2.- 11.88,32.6 v13.12,32.6
SINK1_PRE  (via drill 0.3)
  Top 0.203: v23.06,20.79 23.69,20.79 U1.1 | v28.12,19.67 v27,20.79 | v33.38,21.98 33.38,23.48 32.31,24.54 31.94,24.54 U2.1
  Bottom 0.203: v27,20.79 v23.06,20.79 | v28.12,19.67 31.06,19.67 v33.38,21.98
SINK2  (via drill 0.3)
  Top 0.203: v40.88,25.85 40.5,26.23 38.81,26.23 38.19,25.6 38.19,24.23 37.25,23.29 36.88,23.29 U2.15
  Bottom 0.203: 41.94,23.67 41.06,22.79 41.06,18.17 D11.- 41.06,18.04 41.06,17.29 41.56,16.79 41.56,15.98 40.69,15.1 39.62,15.1 38.19,13.67 38.19,12.6 D10.- 38.12,12.48 38.12,10.85 35.25,7.98 35.25,6.85 D9.- 35.19,7.04 29.5,7.04 29.06,6.6 D8.- 29,6.54 29,6.35 27.81,5.17 20.81,5.17 20.06,5.92 16.38,5.92 D7.- | 41.94,23.67 43.81,23.67 D12.- | v40.88,25.85 40.88,24.73 41.94,23.67
SINK2_PRE  (via drill 0.3)
  Top 0.203: v24.12,19.73 24.19,19.79 24.19,20.79 U1.2 | v30.38,22.73 31.38,22.73 31.88,23.23 U2.2
  Bottom 0.203: v24.12,19.73 27.38,19.73 v30.38,22.73
SINK3  (via drill 0.3)
  Top 0.203: v39.44,24.1 39.25,24.1 38.25,23.1 38.25,23.04 37.25,22.04 36.88,22.04 U2.14
  Bottom 0.203: v39.44,24.1 39.44,24.23 40.12,24.92 40.12,26.1 39.12,27.1 39.12,27.79 40.31,28.98 D13.- 40.38,29.04 40.38,29.29 37,32.67 D14.- 36.94,34.35 36.94,35.35 33.69,38.6 33.69,39.42 D15.- 33.62,39.54 33.19,39.98 28.62,39.98 27.94,39.29 27.31,39.29 D16.- 27.19,39.23 26.12,38.17 22.31,38.17 21.62,38.85 21.06,38.85 D17.- 20.94,38.85 20.5,38.42 16.12,38.42 15.94,38.6 14.81,38.6 D18.-
SINK3_PRE
  Top 0.203: U1.10 28.7,23.28 29.96,22.01 U2.3
SINK4  (via drill 0.3)
  Top 0.203: v32.88,26.67 34.88,24.67 34.88,22.29 36.38,20.79 36.81,20.79 U2.13 | v30.56,32.29 v32.94,29.92
  Bottom 0.203: D24.- 12.44,21.85 12.44,22.1 15.06,24.73 15.06,27.35 D23.- 15.19,27.48 15.44,27.73 17.94,27.73 | 17.94,27.73 21.06,27.73 D21.- | 17.94,27.73 17.94,33.17 D22.- 18,32.92 19.88,32.92 20.56,33.6 24.06,33.6 D20.- 24.19,33.67 25.12,34.6 26.44,34.6 26.94,34.1 30.5,34.1 D19.- 30.56,33.98 v30.56,32.29 | v32.88,26.67 32.88,29.85 v32.94,29.92
SINK4_PRE
  Top 0.203: U1.9 28.46,22.77 30.48,20.74 U2.4
SINK5  (via drill 0.3)
  Top 0.203: v33.81,14.6 33.81,17.98 35.25,19.42 36.81,19.42 U2.12
  Bottom 0.203: 19.22,13.38 16.06,16.54 D27.- 16.12,16.6 18.69,19.17 18.69,21.79 D25.- | 19.22,13.38 19.44,13.17 19.44,11.42 D28.- 19.56,11.35 23.06,11.35 23.56,10.85 24.88,10.85 25.81,11.79 D29.- 25.94,11.85 29.44,11.85 30.12,12.54 31.75,12.54 32,12.29 D30.- 31.81,12.6 v33.81,14.6 | 19.22,13.38 22.62,16.79 D26.-
SINK5_PRE
  Top 0.203: U1.8 28.21,22.26 31,19.47 U2.5
SINK6  (via drill 0.3)
  Top 0.203: v35.5,18.85 36.19,18.85 36.81,18.23 U2.11
  Bottom 0.203: D31.- 34.94,18.1 34.94,18.29 v35.5,18.85 35.5,23.67 | 27.38,23.6 31.25,23.6 D35.- 31.38,23.67 33.44,25.73 | 27.38,23.6 25,23.6 D36.- | 27.38,23.6 27.38,28.6 D34.- | 33.44,25.73 33.44,27.29 33.94,27.79 33.94,28.92 D33.- | 35.5,23.67 37.56,23.67 D32.- | 33.44,25.73 35.5,23.67
SINK6_PRE
  Top 0.203: U1.7 27.95,21.78 30.5,19.23 30.5,18.48 30.77,18.2 U2.6
SINK7  (via drill 0.3)
  Top 0.203: v30.19,17.48 30.19,16.73 30.44,16.48 v30.44,15.17 | v34.38,15.17 34.69,15.17 36.44,16.92 36.81,16.92 U2.10
  Bottom 0.203: v30.19,17.48 30,17.67 28.94,17.67 D37.- | v34.38,15.17 v30.44,15.17
SINK7_PRE
  Top 0.203: U1.11 27.19,23.79 29.5,23.79 30.81,25.1 33,25.1 33.94,24.17 33.94,18.67 33.19,17.92 33.19,17.79 32.38,16.98 31.94,16.98 U2.7